# Altium schematic sheet input3.SchDoc
size A4
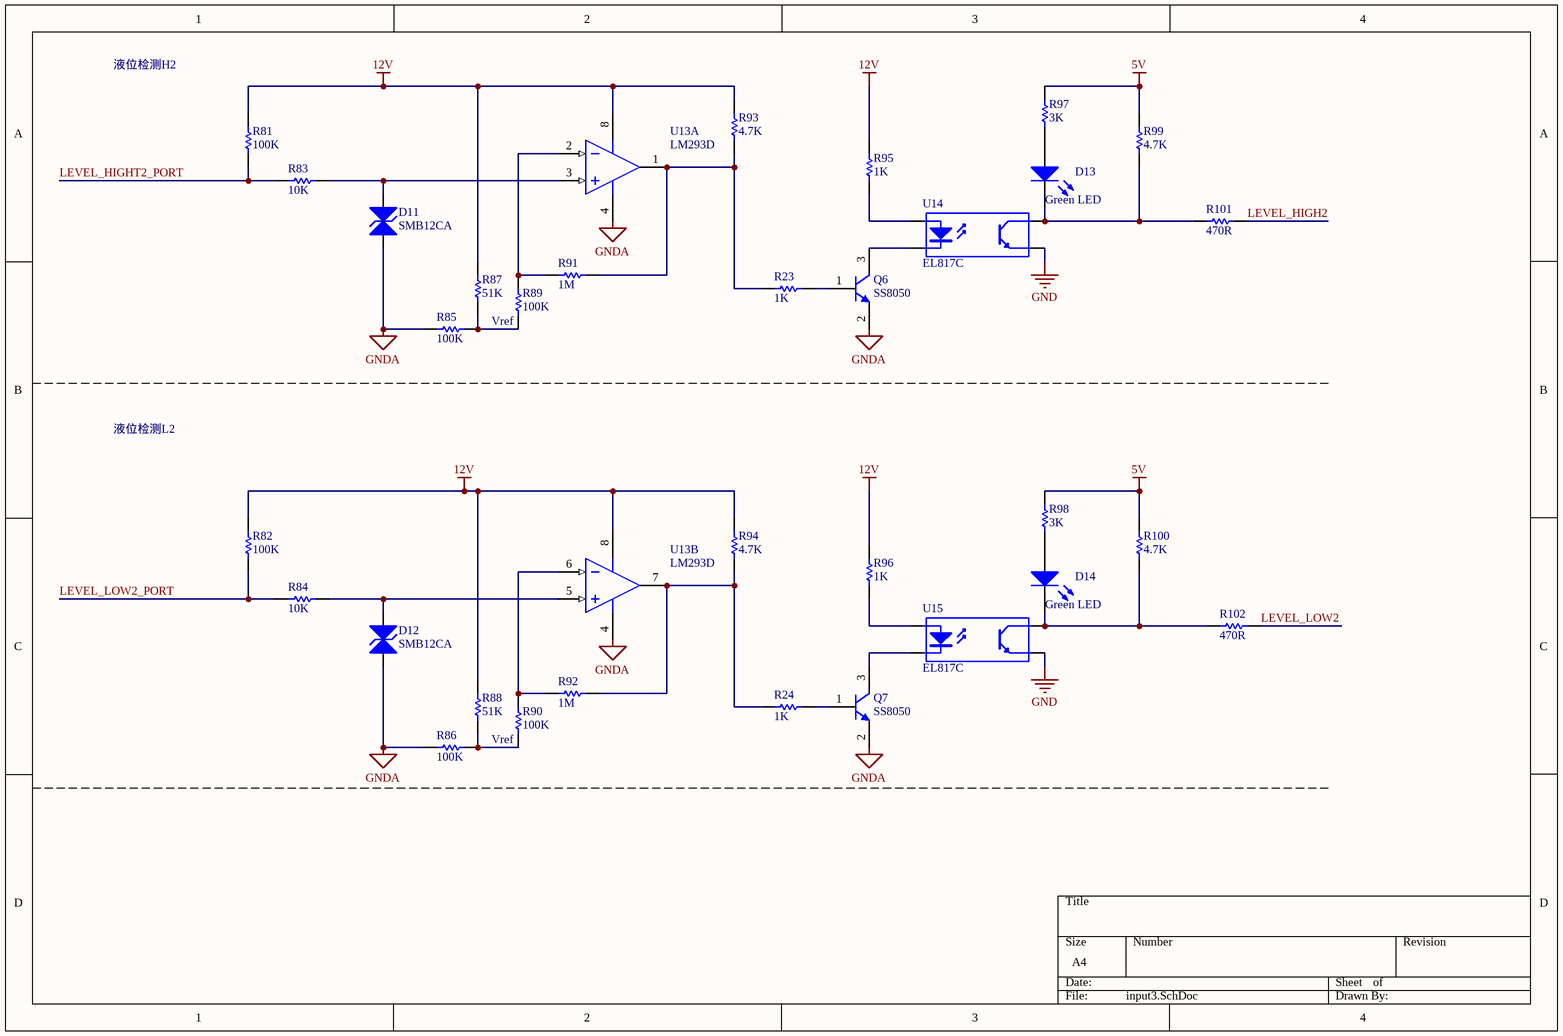
[diagram p0: input3.SchDoc]

## Parts
D11  SMB12CA  [SMB]
D12  SMB12CA  [SMB]
D13  Green LED  [LED254A]
D14  Green LED  [LED254A]
Q6  SS8050  [SOT-23_N]
Q7  SS8050  [SOT-23_N]
R23  1K  [RESC2012M]
R24  1K  [RESC2012M]
R81  100K  [RESC2012M]
R82  100K  [RESC2012M]
R83  10K  [RESC2012M]
R84  10K  [RESC2012M]
R85  100K  [RESC2012M]
R86  100K  [RESC2012M]
R87  51K  [RESC2012M]
R88  51K  [RESC2012M]
R89  100K  [RESC2012M]
R90  100K  [RESC2012M]
R91  1M  [RESC2012M]
R92  1M  [RESC2012M]
R93  4.7K  [RESC2012M]
R94  4.7K  [RESC2012M]
R95  1K  [RESC2012M]
R96  1K  [RESC2012M]
R97  3K  [RESC2012M]
R98  3K  [RESC2012M]
R99  4.7K  [RESC2012M]
R100  4.7K  [RESC2012M]
R101  470R  [RESC2012M]
R102  470R  [RESC2012M]
U13  LM293D  [SO8_N]  (parts A,B of 2)
U14  EL817C  [SO-4LA]
U15  EL817C  [SO-4LA]

## Nets
5V: R97.1 R98.1 R99.2 R100.2
12V: R81.2 R82.2 R87.2 R88.2 R93.1 R94.2 R95.1 R96.1 U13.8(V+)
GND: U14.3(E) U15.3(E)
GNDA: D11.1(A) D12.1(A) Q6.2(E) Q7.2(E) R85.1 R86.1 U13.4(V-)
LEVEL_HIGH2: R101.2
LEVEL_HIGHT2_PORT: R81.1 R83.2
LEVEL_LOW2: R102.2
LEVEL_LOW2_PORT: R82.1 R84.2
NetD11_2: D11.2(K) R83.1 U13.3(IN+)
NetD12_2: D12.2(K) R84.1 U13.5(IN+)
NetD13_1: D13.1(A) R97.2
NetD13_2: D13.2(K) R99.1 R101.1 U14.4(C)
NetD14_1: D14.1(A) R98.2
NetD14_2: D14.2(K) R100.1 R102.1 U15.4(C)
NetQ6_1: Q6.1(B) R23.2
NetQ6_3: Q6.3(C) U14.2(K)
NetQ7_1: Q7.1(B) R24.2
NetQ7_3: Q7.3(C) U15.2(K)
NetR23_1: R23.1 R91.2 R93.2 U13.1(OUT)
NetR24_1: R24.1 R92.2 R94.1 U13.7(OUT)
NetR85_2: R85.2 R87.1 R89.2
NetR86_2: R86.2 R88.1 R90.1
NetR89_1: R89.1 R91.1 U13.2(IN-)
NetR90_2: R90.2 R92.1 U13.6(IN-)
NetR95_2: R95.2 U14.1(A)
NetR96_2: R96.2 U15.1(A)

## Notes on the sheet
- 液位检测H2
- (near R89) Vref
- 液位检测L2
- (near R90) Vref

## Library data of the parts
D11 D12 = Bi-dir TVS Diode: Published: 8-Jun-2000; LatestRevisionDate: 17-Jul-2002; LatestRevisionNote: Re-released for DXP Platform.; PackageReference: DIODE-0.7; Publisher: Altium Limited
D13 D14 = LED1: Green LED ,SIP, Dia =3mm; Published: 8-Jun-2000; LatestRevisionDate: 08-Jul-2005; LatestRevisionNote: Mech Layer 1 removed.; PackageReference: LED-1; Publisher: Altium Limited
Q6 Q7 = PMMT491A: NPN BISS Transistor; Published: 17-Sep-2003; LatestRevisionDate: 12-Dec-2006; LatestRevisionNote: IPC-7351 Footprint Added.; DatasheetVersion: 11-Jun-2001; PackageVersion: May-1999; PackageReference: SOT23; Publisher: Altium Limited; PackageDescription: 3-Pin SOT-23 Package 0.95 mm Pitch, 2.3 mm Lead Span; ComponentLink1Description: Manufacturer Link; ComponentLink1URL: http://www.semiconductors.philips.com/; ComponentLink2Description: Datasheet; ComponentLink2URL: http://www.semiconductors.philips.com/acrobat/datasheets/PMMT491A_5.pdf
R23 R24 R81 R82 R85-R102 = Res1: Resistor; Value: 10K; Published: 8-Jun-2000; LatestRevisionDate: 17-Jul-2002; LatestRevisionNote: Re-released for DXP Platform.; PackageReference: AXIAL-0.3; Publisher: Altium Limited
R83 R84 = Res1: Resistor; Published: 8-Jun-2000; LatestRevisionDate: 17-Jul-2002; LatestRevisionNote: Re-released for DXP Platform.; PackageReference: AXIAL-0.3; Publisher: Altium Limited; Value: 10K
U13 = LM393AD: Low-Power Dual Voltage Comparator; Published: 24-Aug-2001; LatestRevisionDate: 13-Apr-2006; LatestRevisionNote: IPC-7351 Footprint Added.; DatasheetVersion: Nov-1992; PackageVersion: Dec-2002; PackageReference: SO8; Publisher: Altium Limited; PackageDescription: 8-Pin Small Outline Integrated Circuit 1.27 mm Pitch; Code_JEDEC: MS-012-AA; Code_IPC: SOIC127P600-8; ComponentLink1Description: Manufacturer Link; ComponentLink1URL: http://www.st.com/; ComponentLink2Description: Datasheet; ComponentLink2URL: http://www.st.com/stonline/products/literature/ds/2164/lm193.pdf
U14 U15 = Optoisolator1: 4-Pin Phototransistor Optocoupler; Published: 24-Mar-1999; LatestRevisionDate: 04-Mar-2005; LatestRevisionNote: Sch pins 3 & 4 Swapped.; DatasheetVersion: Nov-2003; PackageReference: DIP-4; Publisher: Altium Limited